# Altium schematic sheet fuse_old.SchDoc
size A4; SheetNumber: 3; SheetTotal: 3
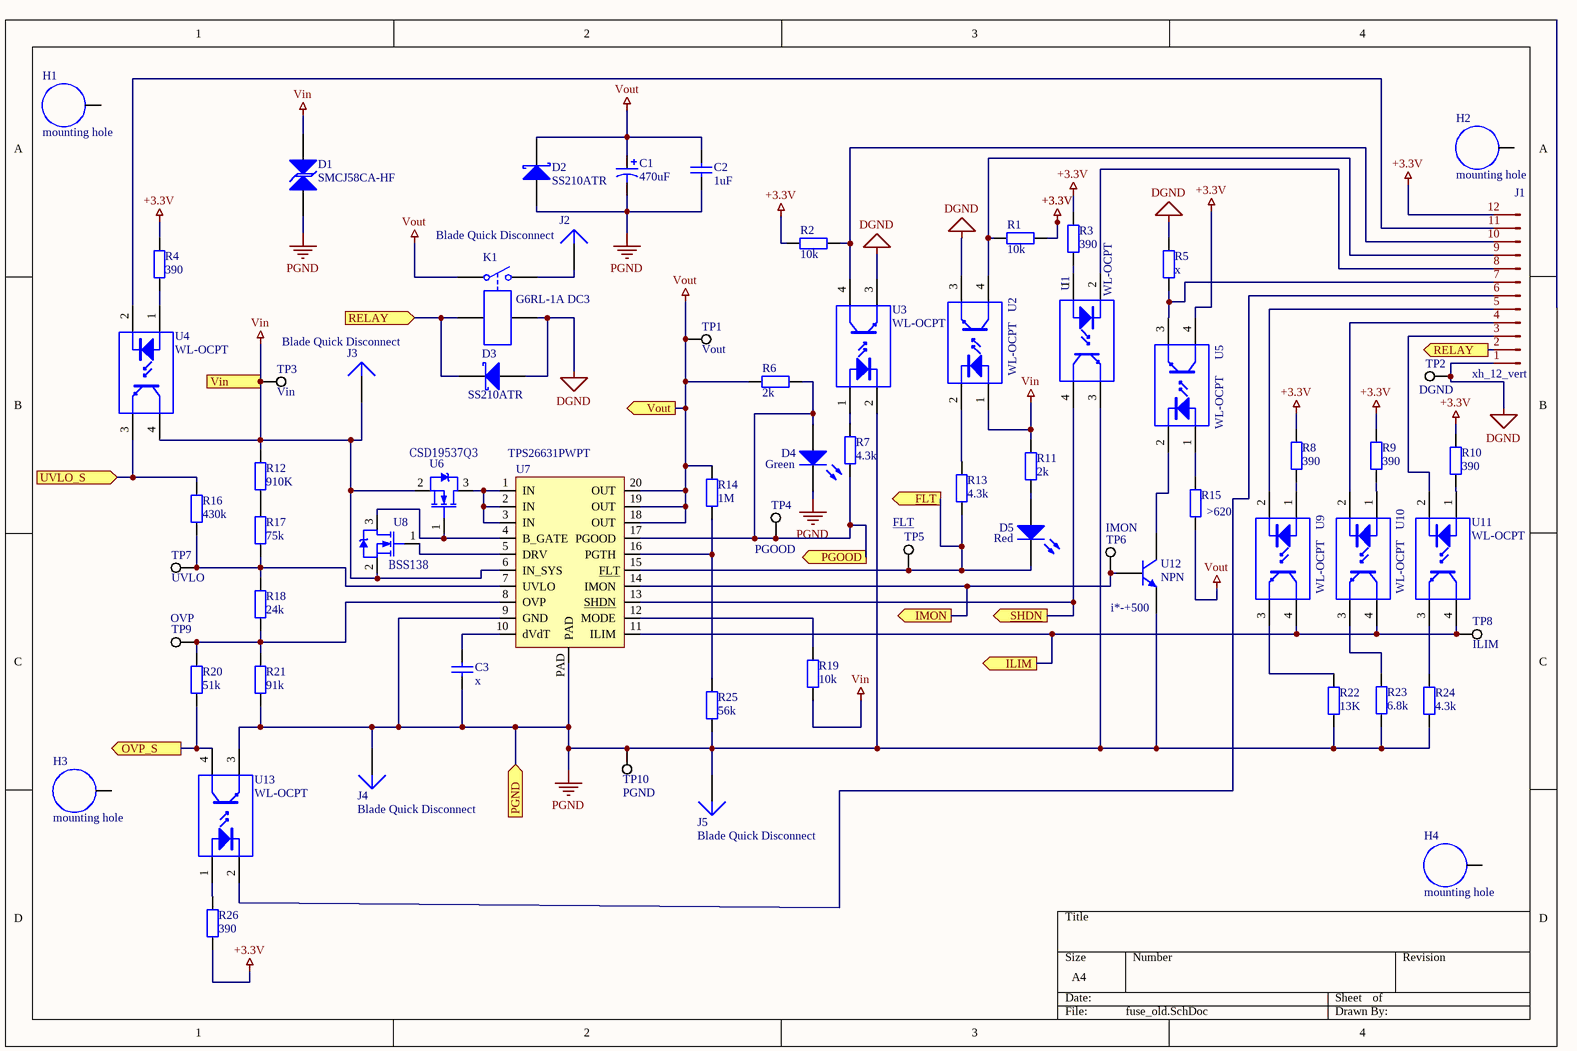
[diagram p0: fuse_old.SchDoc]

## Parts
C1  470uF  [8mm smd cap]
C2  1uF  [0805]
C3  x  [0805]
D1  SMCJ58CA-HF  [DO-214AB-SMC Bipolar]
D2  SS210ATR  [DO-214AC, SMA]
D3  SS210ATR  [DO-214AC, SMA]
D4  Green  [0805 LED]
D5  Red  [0805 LED]
H1  mounting hole  [M3 HOLE iso]
H2  mounting hole  [M3 HOLE iso]
H3  mounting hole  [M3 HOLE iso]
H4  mounting hole  [M3 HOLE iso]
J1  xh_12_vert  [JST_XH_B12B-XH-A_1x12_P2.50mm_Vertical]
J2  Blade Quick Disconnect  [TE blade connector]
J3  Blade Quick Disconnect  [TE blade connector]
J4  Blade Quick Disconnect  [TE blade connector]
J5  Blade Quick Disconnect  [TE blade connector]
K1  G6RL-1A DC3  [G6RL-1A DC3 relay]
R1  10k  [0805]
R2  10k  [0805]
R3  390  [0805]
R4  390  [0805]
R5  x  [0805]
R6  2k  [0805]
R7  4.3k  [0805]
R8  390  [0805]
R9  390  [0805]
R10  390  [0805]
R11  2k  [0805]
R12  910K  [0805]
R13  4.3k  [0805]
R14  1M  [0805]
R15  >620  [0805]
R16  430k  [0805]
R17  75k  [0805]
R18  24k  [0805]
R19  10k  [0805]
R20  51k  [0805]
R21  91k  [0805]
R22  13K  [0805]
R23  6.8k  [0805]
R24  4.3k  [0805]
R25  56k  [0805]
R26  390  [0805]
TP1  Vout  [Test Loop 1.6mm]
TP2  DGND  [Test Loop 1.6mm]
TP3  Vin  [Test Loop 1.6mm]
TP4  PGOOD  [Test Loop 1.6mm]
TP5  FLT  [Test Loop 1.6mm]
TP6  IMON  [Test Loop 1.6mm]
TP7  UVLO  [Test Loop 1.6mm]
TP8  ILIM  [Test Loop 1.6mm]
TP9  OVP  [Test Loop 1.6mm]
TP10  PGND  [Test Loop 1.6mm]
U1  WL-OCPT  [4-SOP_WE_opto-isolator]
U2  WL-OCPT  [4-SOP_WE_opto-isolator]
U3  WL-OCPT  [4-SOP_WE_opto-isolator]
U4  WL-OCPT  [4-SOP_WE_opto-isolator]
U5  WL-OCPT  [4-SOP_WE_opto-isolator]
U6  ‎CSD19537Q3‎  [8-VSON (3,3x3,3)]
U7  TPS26631PWPT  [TSSOP_P065S6.6x6.6]
U8  BSS138‎  [SOT-23-3]
U9  WL-OCPT  [4-SOP_WE_opto-isolator]
U10  WL-OCPT  [4-SOP_WE_opto-isolator]
U11  WL-OCPT  [4-SOP_WE_opto-isolator]
U12  NPN  [SOT23(TO-236AB)P095S230x290]
U13  WL-OCPT  [4-SOP_WE_opto-isolator]

## Ports
FLT (out), ILIM (out), IMON (out), OVP_S (out), PGND (in), PGOOD (out), RELAY (in), RELAY (out), SHDN (out), UVLO_S (in), Vin (out), Vout (out)

## Nets
+3.3V: J1.12(Pin_11) R1.1 R2.1 R3.2 R4.2 R8.2 R9.2 R10.2 R26.2 U5.4(C)
DGND: D3.1(A) J1.1(Pin_1) K1.5 R5.2 TP2.1 U2.3(E) U3.3(E)
PGND: C1.2 C2.1 C3.2 D1.1(A) D2.1(A) D4.2(K) J4.1 J5.1 R21.1 R22.1 R23.1 R24.1 R25.1 TP10.1 U1.3(E) U3.2(C) U7.9(GND) U7.PAD U12.2(E) U13.3(E) ; port PGND
Vin: D1.2(K) J3.1 R11.2 R12.2 R19.1 TP3.1 U2.1(A) U4.4(C) U6.2(D) U7.6(IN_SYS) U8.2(D) ; port Vin
Vout: C1.1 C2.2 D2.2(K) K1.2 R6.2 R14.2 R15.1 TP1.1 U7.18(OUT) U7.19(OUT) U7.20(OUT) ; port Vout
FLT: D5.2(K) R13.1 TP5.1 U7.15(FLT) ; port FLT
ILIM: TP8.1 U7.11(ILIM) U9.4(C) U10.4(C) U11.4(C) ; port ILIM
IMON: TP6.1 U7.14(IMON) U12.1(B) ; port IMON
OVP_S: R20.1 U13.4(C) ; port OVP_S
PGOOD: D4.1(A) R6.1 R7.1 TP4.1 U7.17(PGOOD) ; port PGOOD
RELAY: D3.2(K) J1.2(Pin_2) K1.1 ; port RELAY
SHDN: U1.4(C) U7.13(SHDN) ; port SHDN
UVLO_S: R16.2 U4.3(E) ; port UVLO_S
NetC3_1: C3.1 U7.10(dVdT)
NetD5_1: D5.1(A) R11.1
NetJ1_3: J1.3(Pin_3) U11.2(C)
NetJ1_4: J1.4(Pin_4) U10.2(C)
NetJ1_5: J1.5(Pin_5) U9.2(C)
NetJ1_6: J1.6(Pin_6) U13.2(C)
NetJ1_7: J1.7(Pin_7) R5.1 U5.3(E)
NetJ1_8: J1.8(Pin_8) U1.2(C)
NetJ1_9: J1.9(Pin_9) R1.2 U2.4(C)
NetJ1_10: J1.10(Pin_10) R2.2 U3.4(C)
NetJ1_11: J1.11(Pin_11) U4.2(C)
NetJ2_1: J2.1 K1.3
NetR3_1: R3.1 U1.1(A)
NetR4_1: R4.1 U4.1(A)
NetR7_2: R7.2 U3.1(A)
NetR8_1: R8.1 U9.1(A)
NetR9_1: R9.1 U10.1(A)
NetR10_1: R10.1 U11.1(A)
NetR12_1: R12.1 R17.2
NetR13_2: R13.2 U2.2(C)
NetR14_1: R14.1 R25.2 U7.16(PGTH)
NetR15_2: R15.2 U5.1(A)
NetR16_1: R16.1 R17.1 R18.2 TP7.1 U7.7(UVLO)
NetR18_1: R18.1 R20.2 R21.2 TP9.1 U7.8(OVP)
NetR19_2: R19.2 U7.12(MODE)
NetR22_2: R22.2 U9.3(E)
NetR23_2: R23.2 U10.3(E)
NetR24_2: R24.2 U11.3(E)
NetR26_1: R26.1 U13.1(A)
NetU5_2: U5.2(C) U12.3(C)
NetU6_1: U6.1(G) U7.4(B_GATE) U8.3(S)
NetU6_3: U6.3(S) U7.1(IN) U7.2(IN) U7.3(IN)
NetU7_5: U7.5(DRV) U8.1(G)

Not connected (* = marked no-connect by the designer): H1 1; H2 1; H3 1; H4 1

## Notes on the sheet
- (near U12) i*-+500

## Library data of the parts
C1 = cap pol
C2 C3 = cap
D1 = TVS Diode
D2 D3 = shotkey diode
D4 D5 = LED
K1 = Relay
R1-R26 = res0805
TP1-TP10 = Test point
U1-U5 U9-U11 U13 = optoc WE
U6 U8 = N-mosfet en